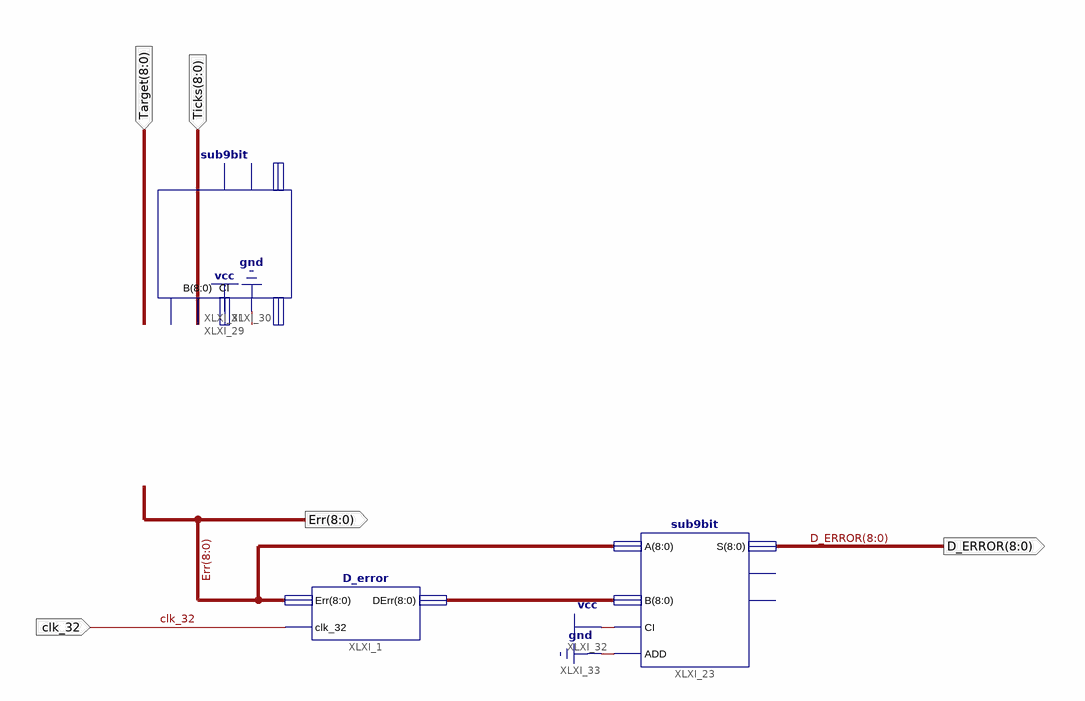
[diagram p0: schematic sheet 1]
// Xilinx ISE schematic Error_D_Error_Gen.sch (spartan3e) as structural Verilog: 3 symbols, 5 ports
module Error_D_Error_Gen (
  input  clk_32,
  input  [8:0] Ticks,
  input  [8:0] Target,
  output [8:0] D_ERROR,
  output [8:0] Err
);

  wire [8:0] XLXN_17;

  D_error XLXI_1 (.Err(Err), .clk_32(clk_32), .DErr(XLXN_17));
  sub9bit XLXI_23 (.A(Err), .B(XLXN_17), .CI(1'b1), .ADD(1'b0), .S(D_ERROR));  // open: OFL, CO
  sub9bit XLXI_29 (.A(Target), .B(Ticks), .CI(1'b1), .ADD(1'b0), .S(Err));  // open: OFL, CO
endmodule
